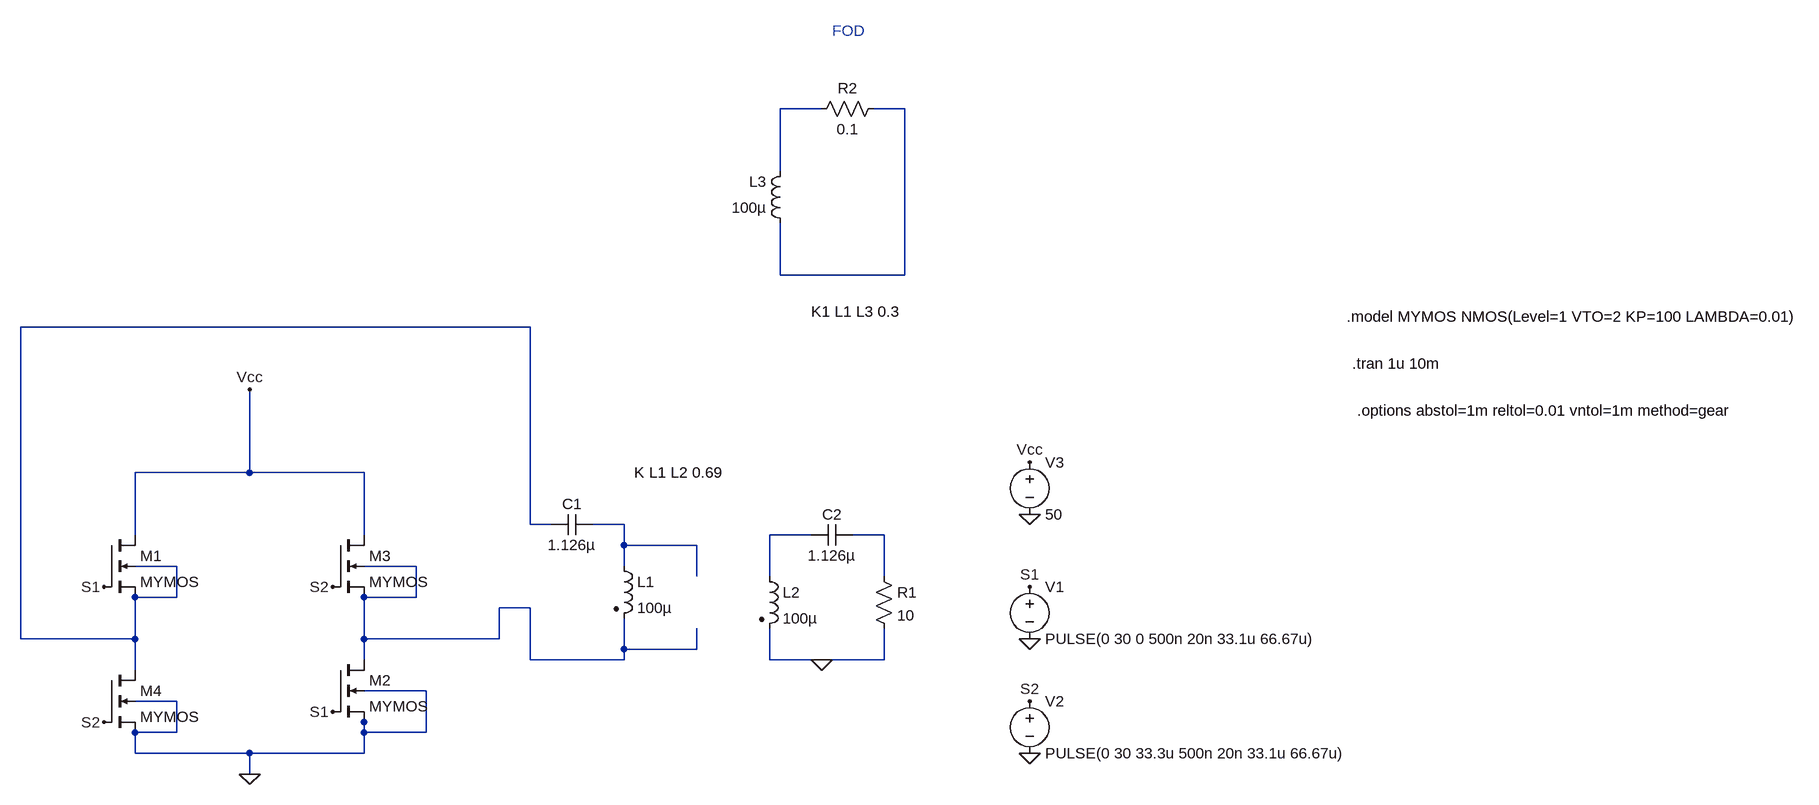
[diagram p0: schematic FOD - SYSTEM 1 SS H BRIDGE.asc]
FOD - SYSTEM 1 SS H BRIDGE.asc, the LTspice schematic file:
Version 4.1
SHEET 1 1556 692
WIRE 16 -352 -48 -352
WIRE 144 -352 96 -352
WIRE -48 -256 -48 -352
WIRE -48 -96 -48 -176
WIRE 144 -96 144 -352
WIRE 144 -96 -48 -96
WIRE -432 -16 -1216 -16
WIRE -864 208 -864 80
WIRE -864 208 -1040 208
WIRE -688 208 -864 208
WIRE -432 288 -432 -16
WIRE -400 288 -432 288
WIRE -288 288 -336 288
WIRE -1040 304 -1040 208
WIRE -688 304 -688 208
WIRE 0 304 -64 304
WIRE 112 304 64 304
WIRE -288 320 -288 288
WIRE -176 320 -288 320
WIRE -976 352 -1040 352
WIRE -608 352 -688 352
WIRE -288 352 -288 320
WIRE -176 368 -176 320
WIRE -64 368 -64 304
WIRE 112 368 112 304
WIRE -976 400 -976 352
WIRE -976 400 -1040 400
WIRE -688 400 -688 384
WIRE -608 400 -608 352
WIRE -608 400 -688 400
WIRE -432 416 -480 416
WIRE -1216 464 -1216 -16
WIRE -1040 464 -1040 400
WIRE -1040 464 -1216 464
WIRE -688 464 -688 400
WIRE -480 464 -480 416
WIRE -480 464 -688 464
WIRE -288 480 -288 432
WIRE -176 480 -176 448
WIRE -176 480 -288 480
WIRE -688 496 -688 464
WIRE -432 496 -432 416
WIRE -288 496 -288 480
WIRE -288 496 -432 496
WIRE -64 496 -64 448
WIRE 16 496 -64 496
WIRE 112 496 112 448
WIRE 112 496 16 496
WIRE -1040 512 -1040 464
WIRE -592 544 -688 544
WIRE -976 560 -1040 560
WIRE -688 592 -688 576
WIRE -976 608 -976 560
WIRE -976 608 -1040 608
WIRE -688 608 -688 592
WIRE -592 608 -592 544
WIRE -592 608 -688 608
WIRE -1040 640 -1040 608
WIRE -864 640 -1040 640
WIRE -688 640 -688 608
WIRE -688 640 -864 640
WIRE -864 672 -864 640
FLAG -864 80 Vcc
FLAG -864 672 0
FLAG -1088 384 S1
FLAG -736 384 S2
FLAG -736 576 S1
FLAG -1088 592 S2
FLAG 336 384 S1
FLAG 336 464 0
FLAG 336 560 S2
FLAG 336 640 0
FLAG 336 192 Vcc
FLAG 336 272 0
FLAG 16 496 0
SYMBOL nmos4 -1088 304 R0
SYMATTR InstName M1
SYMATTR Value MYMOS
SYMBOL nmos4 -736 496 R0
SYMATTR InstName M2
SYMATTR Value MYMOS
SYMBOL nmos4 -736 304 R0
SYMATTR InstName M3
SYMATTR Value MYMOS
SYMBOL nmos4 -1088 512 R0
SYMATTR InstName M4
SYMATTR Value MYMOS
SYMBOL ind2 -304 336 R0
SYMATTR InstName L1
SYMATTR Value 100µ
SYMATTR Type ind
SYMATTR SpiceLine Rser=0.1
SYMBOL cap -400 272 M90
WINDOW 0 0 32 VBottom 2
WINDOW 3 32 32 VTop 2
SYMATTR InstName C1
SYMATTR Value 1.126µ
SYMBOL cap 0 288 M90
WINDOW 0 0 32 VBottom 2
WINDOW 3 32 32 VTop 2
SYMATTR InstName C2
SYMATTR Value 1.126µ
SYMBOL res 96 352 R0
SYMATTR InstName R1
SYMATTR Value 10
SYMBOL ind2 -80 352 R0
SYMATTR InstName L2
SYMATTR Value 100µ
SYMATTR Type ind
SYMATTR SpiceLine Rser=0.1
SYMBOL voltage 336 368 R0
WINDOW 123 0 0 Left 0
WINDOW 39 0 0 Left 0
SYMATTR InstName V1
SYMATTR Value PULSE(0 30 0 500n 20n 33.1u 66.67u)
SYMBOL voltage 336 544 R0
WINDOW 123 0 0 Left 0
WINDOW 39 0 0 Left 0
SYMATTR InstName V2
SYMATTR Value PULSE(0 30 33.3u 500n 20n 33.1u 66.67u)
SYMBOL voltage 336 176 R0
WINDOW 123 0 0 Left 0
WINDOW 39 0 0 Left 0
SYMATTR InstName V3
SYMATTR Value 50
SYMBOL ind -32 -160 R180
WINDOW 0 36 80 Left 2
WINDOW 3 36 40 Left 2
SYMATTR InstName L3
SYMATTR Value 100µ
SYMATTR Type ind
SYMBOL res 112 -368 R90
WINDOW 0 0 56 VBottom 2
WINDOW 3 32 56 VTop 2
SYMATTR InstName R2
SYMATTR Value 0.1
TEXT 832 40 Left 2 !.tran 1u 10m
TEXT -272 208 Left 2 !K L1 L2 0.69
TEXT 824 -32 Left 2 !.model MYMOS NMOS(Level=1 VTO=2 KP=100 LAMBDA=0.01)
TEXT 840 112 Left 2 !.options abstol=1m reltol=0.01 vntol=1m method=gear
TEXT 0 -40 Left 2 !K1 L1 L3 0.3
TEXT 32 -472 Left 2 ;FOD

The netlist it stands for:
* FOD - SYSTEM 1 SS H BRIDGE.asc
M1 Vcc S1 N003 N003 MYMOS
M2 N007 S1 0 0 MYMOS
M3 Vcc S2 N007 N007 MYMOS
M4 N003 S2 0 0 MYMOS
L1 N004 N007 100µ Rser=0.1
C1 N003 N004 1.126µ
C2 N005 N006 1.126µ
R1 N006 0 10
L2 N005 0 100µ Rser=0.1
V1 S1 0 PULSE(0 30 0 500n 20n 33.1u 66.67u)
V2 S2 0 PULSE(0 30 33.3u 500n 20n 33.1u 66.67u)
V3 Vcc 0 50
L3 N002 N001 100µ
R2 N002 N001 0.1
.model NMOS NMOS
.model PMOS PMOS
.lib standard.mos
.tran 1u 10m
K L1 L2 0.69
.model MYMOS NMOS(Level=1 VTO=2 KP=100 LAMBDA=0.01)
.options abstol=1m reltol=0.01 vntol=1m method=gear
K1 L1 L3 0.3
* FOD
.backanno
.end